# Altium schematic sheet ZLS-017.SchDoc: ZLS-017
size OrCAD A
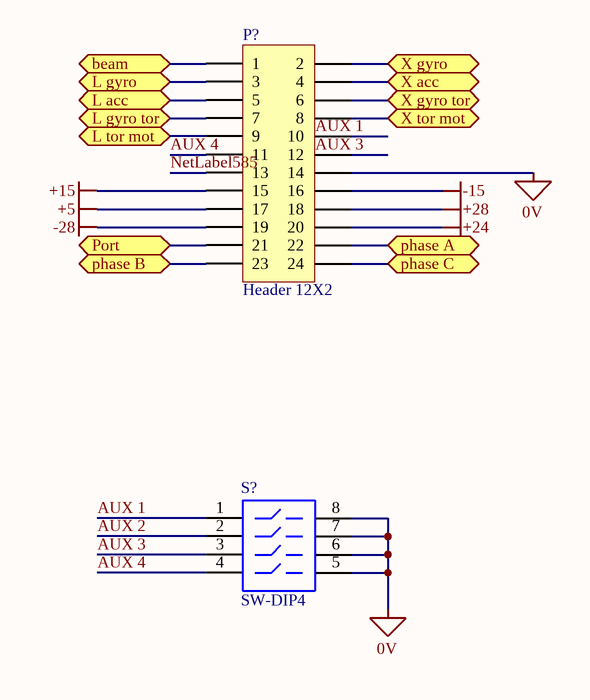
[diagram p0: ZLS-017.SchDoc]

## Parts
P?  Header 12X2  [HDR2X12]
S?  SW-DIP4  [DIP-8]

## Ports
beam, L acc, L gyro, L gyro tor, L tor mot, phase A, phase B, phase C, Port, X acc, X gyro, X gyro tor, X tor mot

## Nets
0V: P?.14 S?.5 S?.6 S?.7 S?.8
+5: P?.17
+15: P?.15
+24: P?.20
+28: P?.18
-15: P?.16
-28: P?.19
AUX 1: S?.1
AUX 2: S?.2
AUX 3: S?.3
AUX 4: P?.11 S?.4
beam: P?.1 ; port beam
L acc: P?.5 ; port L acc
L gyro: P?.3 ; port L gyro
L gyro tor: P?.7 ; port L gyro tor
L tor mot: P?.9 ; port L tor mot
NetLabel585: P?.13
phase A: P?.22 ; port phase A
phase B: P?.23 ; port phase B
phase C: P?.24 ; port phase C
Port: P?.21 ; port Port
X acc: P?.4 ; port X acc
X gyro: P?.2 ; port X gyro
X gyro tor: P?.6 ; port X gyro tor
X tor mot: P?.8 ; port X tor mot

Not connected (* = marked no-connect by the designer): P? 10 12

## Notes on the sheet
- Labels drawn without touching a wire or pin: AUX 1, AUX 3
- Title
- Size:
- Date:
- Orcad A
- Number:
- Time:
- Revision:
- Sheet
- of
- ZLS Corporation
- 7801 North Lamar Blvd
- Suite E-184
- Austin, TX  78752
- Phone: (512) 453-0288
- File:

## Library data of the parts
P? = Header 12X2: Header, 12-Pin, Dual row; LatestRevisionDate: 17-Jul-2002; LatestRevisionNote: Re-released for DXP Platform.; Publisher: Altium Limited
S? = SW-DIP4: DIP Switch; Published: 24-Mar-1999; LatestRevisionDate: 17-Jul-2002; LatestRevisionNote: Re-released for DXP Platform.; PackageReference: DIP-8; Publisher: Altium Limited